# EAGLE design 3 way omnetics small (EAGLE 7.2.0)
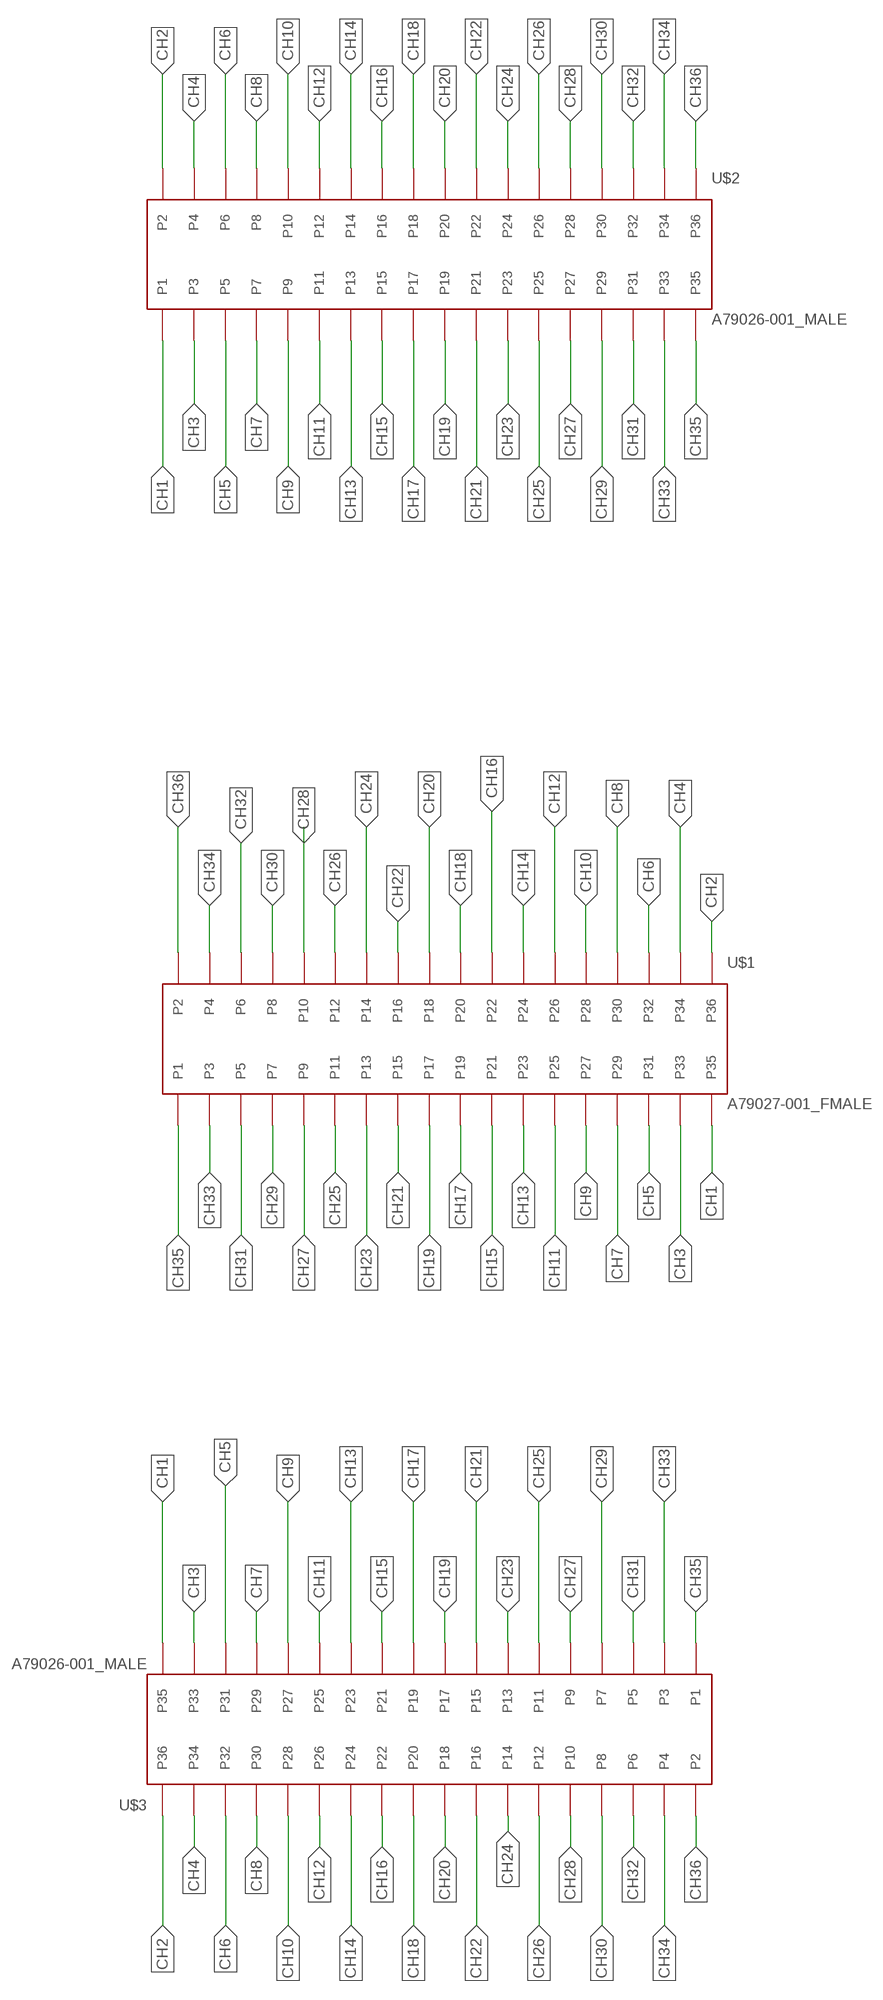
[diagram p0: schematic, sheet 1]

## Parts
U$1  A79027-001_FMALE  [A79026-001_MALE]
U$2  A79026-001_MALE  [A79026-001_MALE]
U$3  A79026-001_MALE  [A79026-001_MALE]

## Nets
CH1: U$1.P35 U$2.P1 U$3.P35
CH2: U$1.P36 U$2.P2 U$3.P36
CH3: U$1.P33 U$2.P3 U$3.P33
CH4: U$1.P34 U$2.P4 U$3.P34
CH5: U$1.P31 U$2.P5 U$3.P31
CH6: U$1.P32 U$2.P6 U$3.P32
CH7: U$1.P29 U$2.P7 U$3.P29
CH8: U$1.P30 U$2.P8 U$3.P30
CH9: U$1.P27 U$2.P9 U$3.P27
CH10: U$1.P28 U$2.P10 U$3.P28
CH11: U$1.P25 U$2.P11 U$3.P25
CH12: U$1.P26 U$2.P12 U$3.P26
CH13: U$1.P23 U$2.P13 U$3.P23
CH14: U$1.P24 U$2.P14 U$3.P24
CH15: U$1.P21 U$2.P15 U$3.P21
CH16: U$1.P22 U$2.P16 U$3.P22
CH17: U$1.P19 U$2.P17 U$3.P19
CH18: U$1.P20 U$2.P18 U$3.P20
CH19: U$1.P17 U$2.P19 U$3.P17
CH20: U$1.P18 U$2.P20 U$3.P18
CH21: U$1.P15 U$2.P21 U$3.P15
CH22: U$1.P16 U$2.P22 U$3.P16
CH23: U$1.P13 U$2.P23 U$3.P13
CH24: U$1.P14 U$2.P24 U$3.P14
CH25: U$1.P11 U$2.P25 U$3.P11
CH26: U$1.P12 U$2.P26 U$3.P12
CH27: U$1.P9 U$2.P27 U$3.P9
CH28: U$1.P10 U$2.P28 U$3.P10
CH29: U$1.P7 U$2.P29 U$3.P7
CH30: U$1.P8 U$2.P30 U$3.P8
CH31: U$1.P5 U$2.P31 U$3.P5
CH32: U$1.P6 U$2.P32 U$3.P6
CH33: U$1.P3 U$2.P33 U$3.P3
CH34: U$1.P4 U$2.P34 U$3.P4
CH35: U$1.P1 U$2.P35 U$3.P1
CH36: U$1.P2 U$2.P36 U$3.P2

## Library data of the parts
U$1 = omnetics:A79027-001_FMALE
U$2 U$3 = omnetics:A79026-001_MALE

## Board
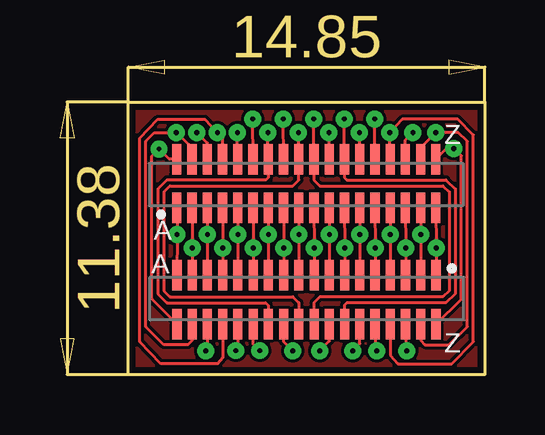
[diagram p1: board, top side]
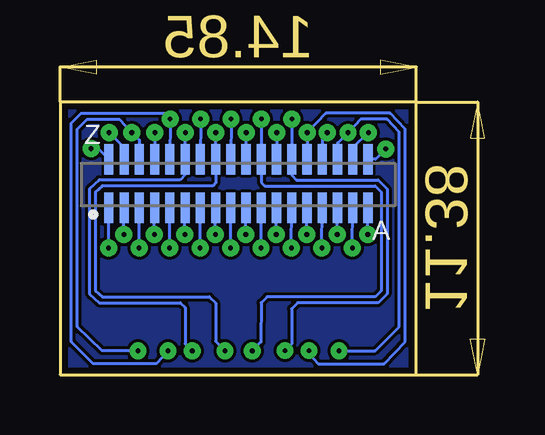
[diagram p2: board, bottom side, seen from below]

Size 14.85 x 11.38 mm. Coordinates in mm from the lower left corner, seen from the top.
Outline: 0,11.38 14.85,11.38 14.85,0 0,0 0,11.38
Copper layers (1*16): Top 0.035mm / dielectric 1.5mm / Bottom 0.035mm
Design rules "pcbtrain *": minimum track width 0.125mm, minimum drill 0.2mm, track to track 0.125mm, track to pad 0.125mm, pad to pad 0.125mm, via to via 0.125mm, smd to smd 0mil, copper to edge 10mil, drill to drill 0.2mm, minimum pad ring 10mil, minimum via ring 10mil, stop-mask expansion 0.125mm, vias tented up to drill 0mil, thermal gap 10mil

### Footprints (pad centres in the part's own frame; a part is rotated, then mirrored left to right if it is on the bottom)
A79026-001_MALE = smd 0.381 x 1.27: P1 -5.397,-1.016; P2 -5.397,1.016; P3 -4.763,-1.016; P4 -4.763,1.016; P5 -4.128,-1.016; P6 -4.128,1.016; P7 -3.493,-1.016; P8 -3.493,1.016; P9 -2.857,-1.016; P10 -2.857,1.016; P11 -2.223,-1.016; P12 -2.223,1.016; P13 -1.587,-1.016; P14 -1.587,1.016; P15 -0.953,-1.016; P16 -0.953,1.016; P17 -0.318,-1.016; P18 -0.318,1.016; P19 0.318,-1.016; P20 0.318,1.016; P21 0.953,-1.016; P22 0.953,1.016; P23 1.587,-1.016; P24 1.587,1.016; P25 2.223,-1.016; P26 2.223,1.016; P27 2.857,-1.016; P28 2.857,1.016; P29 3.493,-1.016; P30 3.493,1.016; P31 4.128,-1.016; P32 4.128,1.016; P33 4.763,-1.016; P34 4.763,1.016; P35 5.397,-1.016; P36 5.397,1.016

### Placement (x,y rotation side)
U$1  7.42,7.97 0 bottom
U$2  7.42,7.97 0 top
U$3  7.42,3.12 180 top

### Tracks (layer width: path | path; a pad name or v marks a point on that pad's centre or on a via)
CH1  (via drill 0.2)
  Top 0.125: U$1.P35 v2.03,5.84 U$3.P35
  Bottom 0.125: v2.03,5.84 U$1.P35
CH2  (via drill 0.2)
  Top 0.125: U$1.P36 1.7,8.99 v1.28,9.41 0.98,9.12 0.98,3.16 U$3.P36
  Bottom 0.125: v1.28,9.41 1.7,8.99 U$1.P36
CH3  (via drill 0.2)
  Top 0.125: U$1.P33 v2.67,5.28 U$3.P33
  Bottom 0.125: v2.67,5.28 U$1.P33
CH4  (via drill 0.2)
  Top 0.125: U$1.P34 2.65,9.46 v2,10.1 v1.99,10.09 1.08,10.09 0.73,9.73 0.73,2 1.48,1.25 2.48,1.25 2.66,1.43 U$3.P34
  Bottom 0.125: v2,10.1 2.65,9.46 U$1.P34
CH5  (via drill 0.2)
  Top 0.125: U$1.P31 v3.3,5.84 U$3.P31
  Bottom 0.125: v3.3,5.84 U$1.P31
CH6  (via drill 0.2)
  Top 0.125: U$1.P32 3.29,9.66 v2.85,10.1 | U$3.P32 3.29,1.07 v3.23,1
  Bottom 0.125: U$1.P32 3.29,9.66 v2.85,10.1 2.33,10.65 1.23,10.65 0.73,10.12 0.73,2 1.73,1 v3.23,1
CH7  (via drill 0.2)
  Top 0.125: U$1.P29 v3.94,5.28 U$3.P29
  Bottom 0.125: v3.94,5.28 U$1.P29
CH8  (via drill 0.2)
  Top 0.125: U$1.P30 3.93,9.88 v3.71,10.1 3.19,10.65 1.23,10.65 0.48,9.88 0.48,1.38 1.35,0.45 3.73,0.45 3.93,0.7 U$3.P30
  Bottom 0.125: v3.71,10.1 3.93,9.88 U$1.P30
CH9  (via drill 0.2)
  Top 0.125: U$1.P27 v4.57,5.84 U$3.P27
  Bottom 0.125: v4.57,5.84 U$1.P27
CH10  (via drill 0.2)
  Top 0.125: U$1.P28 v4.55,10.1 | U$3.P28 4.56,1.09 v4.48,1
  Bottom 0.125: U$1.P28 v4.55,10.1 3.77,10.9 1.1,10.9 0.48,10.25 0.48,1.38 1.35,0.45 4.1,0.45 4.48,0.88 v4.48,1
CH11  (via drill 0.2)
  Top 0.125: U$1.P25 v5.21,5.28 U$3.P25
  Bottom 0.125: v5.21,5.28 U$1.P25
CH12  (via drill 0.2)
  Top 0.125: U$1.P26 v5.19,10.66 | v5.48,1 5.2,1.28 U$3.P26
  Bottom 0.125: v5.19,10.66 U$1.P26 5.19,8.32 5,8.12 1.6,8.12 1.23,7.75 1.23,3.38 1.6,3 4.95,3 5.2,2.75 5.2,1.27 v5.48,1
CH13  (via drill 0.2)
  Top 0.125: U$1.P23 v5.84,5.84 U$3.P23
  Bottom 0.125: v5.84,5.84 U$1.P23
CH14  (via drill 0.2)
  Top 0.125: v5.82,10.1 U$1.P24 5.83,8.23 5.73,8.12 1.6,8.12 1.23,7.75 1.23,3.38 1.6,3 5.72,3 5.83,2.89 5.83,2.12 U$3.P24
  Bottom 0.125: v5.82,10.1 U$1.P24
CH15  (via drill 0.2)
  Top 0.125: U$1.P21 v6.48,5.28 U$3.P21
  Bottom 0.125: v6.48,5.28 U$1.P21
CH16  (via drill 0.2)
  Top 0.125: U$1.P22 v6.46,10.66 | v6.85,1 6.47,1.37 U$3.P22
  Bottom 0.125: v6.46,10.66 U$1.P22 6.46,8.01 6.33,7.88 1.73,7.88 1.48,7.62 1.48,3.5 1.73,3.25 6.23,3.25 6.48,3 6.49,1.35 v6.85,1
CH17  (via drill 0.2)
  Top 0.125: U$1.P19 v7.11,5.84 U$3.P19
  Bottom 0.125: v7.11,5.84 U$1.P19
CH18  (via drill 0.2)
  Top 0.125: v7.09,10.1 U$1.P20 7.1,8.12 6.85,7.88 1.73,7.88 1.48,7.62 1.48,3.5 1.73,3.25 6.85,3.25 7.1,3 U$3.P20
  Bottom 0.125: U$1.P20 v7.09,10.1
CH19  (via drill 0.2)
  Top 0.125: U$1.P17 v7.75,5.28 U$3.P17
  Bottom 0.125: v7.75,5.28 U$1.P17
CH20  (via drill 0.2)
  Top 0.125: v7.73,10.66 U$1.P18 7.73,8.12 7.98,7.88 13.1,7.88 13.38,7.62 13.38,3.5 13.1,3.25 7.98,3.25 7.73,3 7.73,2.12 U$3.P18
  Bottom 0.125: v7.73,10.66 U$1.P18
CH21  (via drill 0.2)
  Top 0.125: U$1.P15 v8.38,5.84 U$3.P15
  Bottom 0.125: v8.38,5.84 U$1.P15
CH22  (via drill 0.2)
  Top 0.125: v8.36,10.1 U$1.P16 | v7.98,1 8.37,1.4 U$3.P16
  Bottom 0.125: v8.36,10.1 U$1.P16 8.37,7.98 8.48,7.88 13.1,7.88 13.38,7.62 13.38,3.5 13.1,3.25 8.63,3.25 8.37,2.99 8.37,1.4 v7.98,1
CH23  (via drill 0.2)
  Top 0.125: U$1.P13 v9.02,5.28 U$3.P13
  Bottom 0.125: v9.02,5.28 U$1.P13
CH24  (via drill 0.2)
  Top 0.125: v9,10.66 U$1.P14 9,8.22 9.1,8.12 13.23,8.12 13.62,7.75 13.62,3.38 13.23,3 9.11,3 9,2.89 9,2.12 U$3.P14
  Bottom 0.125: v9,10.66 U$1.P14
CH25  (via drill 0.2)
  Top 0.125: U$1.P11 v9.65,5.84 U$3.P11
  Bottom 0.125: v9.65,5.84 U$1.P11
CH26  (via drill 0.2)
  Top 0.125: v9.62,10.1 U$1.P12 | v9.35,1 9.64,1.29 U$3.P12
  Bottom 0.125: v9.62,10.1 U$1.P12 9.64,8.34 9.85,8.12 13.23,8.12 13.62,7.75 13.62,3.38 13.23,3 9.84,3 9.64,2.8 9.64,1.29 v9.35,1
CH27  (via drill 0.2)
  Top 0.125: U$1.P9 v10.29,5.28 U$3.P9
  Bottom 0.125: v10.29,5.28 U$1.P9
CH28  (via drill 0.2)
  Top 0.125: U$1.P10 v10.27,10.66 | U$3.P10 10.28,1.07 v10.35,1
  Bottom 0.125: U$1.P10 v10.27,10.66 10.48,10.9 13.98,10.9 14.38,10.5 14.38,1.38 13.48,0.45 10.85,0.45 v10.35,1
CH29  (via drill 0.2)
  Top 0.125: U$1.P7 v10.92,5.84 U$3.P7
  Bottom 0.125: v10.92,5.84 U$1.P7
CH30  (via drill 0.2)
  Top 0.125: U$1.P8 v10.9,10.1 11.42,10.65 13.73,10.65 14.38,10 14.38,1.38 13.48,0.45 11.23,0.45 10.91,0.81 U$3.P8
  Bottom 0.125: v10.9,10.1 U$1.P8
CH31  (via drill 0.2)
  Top 0.125: U$1.P5 v11.55,5.28 U$3.P5
  Bottom 0.125: v11.55,5.28 U$1.P5
CH32  (via drill 0.2)
  Top 0.125: U$2.P32 11.54,9.78 v11.86,10.1 | U$3.P6 11.55,1.05 v11.6,1
  Bottom 0.125: U$2.P32 11.54,9.78 v11.86,10.1 12.38,10.65 13.73,10.65 14.12,10.25 14.12,2 13.1,1 v11.6,1
CH33  (via drill 0.2)
  Top 0.125: U$1.P3 v12.19,5.84 U$3.P3
  Bottom 0.125: v12.19,5.84 U$1.P3
CH34  (via drill 0.2)
  Top 0.125: U$2.P34 12.18,9.47 v12.8,10.1 13.74,10.1 14.12,9.73 14.12,2 13.35,1.25 12.35,1.25 12.18,1.42 U$3.P4
  Bottom 0.125: v12.8,10.1 12.18,9.47 U$2.P34
CH35  (via drill 0.2)
  Top 0.125: U$1.P1 v12.83,5.28 U$3.P1
  Bottom 0.125: v12.83,5.28 U$1.P1
CH36  (via drill 0.2)
  Top 0.125: U$1.P2 13.25,9.43 v13.55,9.43 13.88,9.13 13.88,3.14 U$3.P2
  Bottom 0.125: U$1.P2 13.25,9.43 v13.55,9.43
N$1
  pour Bottom: -0.05,11.32 14.85,11.32 14.85,0.02 -0.05,0.02
N$3
  pour Top: -0.05,11.43 14.85,11.43 14.85,0.02 -0.05,0.02

### Text on the board
tNames: Z | A | A | Z
bNames: Z | A